# Altium schematic sheet GH1.25MM-4P-LT.schdoc
size 127 x 101 mm
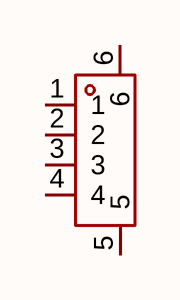
[diagram p0: GH1.25MM-4P-LT.schdoc]

## Parts
CN?  gh1.25mm-4p-lt  [CONN-SMD_GH1.25MM-4P-LT]  (value not drawn)

## Nets

Not connected (* = marked no-connect by the designer): CN? 1 2 3 4 5 6

## Library data of the parts
CN? = gh1.25mm-4p-lt: 插针结构:1x4P;间距:1.25mm;安装方式:立贴;参考系列:GH;总PIN数:4P;排数:1;每排PIN数:4;额定电流:1A;触头材质:磷铜;触头镀层:锡;工作温度:-25℃~+85℃;; Manufacturer: LXWCONN(连兴旺电子); AddInBom: yes; Pins Structure: 1x4P; Pitch: 1.25mm; Reference Series: GH; Number of PINs Per Row: 4; Current Rating: 1A; Voltage Rating: 50V; Plastic Material: LCP; LCSC Part Name: 1x4P 间距:1.25mm 立贴 系列:GH; SupplierPart: C53055373; ManufacturerPart: GH1.25mm-4P-LT; Supplier Footprint: SMD,P=1.25mm; JLCPCB Part Class: Extended Part; Datasheet: https://item.szlcsc.com/datasheet/GH1.25mm-4P-LT/55999573.html; Supplier: LCSC; ConvertToPcb: yes; SymbolName: GH1.25MM-4P-LT; FootprintName: CONN-SMD_GH1.25MM-4P-LT; Mounting Type: 立贴; Number of Pins: 4P; Number of Rows: 1; Contact Material: 磷铜; Contact Plating: 锡; Operating Temperature: -25℃~+85℃